# Altium schematic sheet DeskClock1.SchDoc
size B
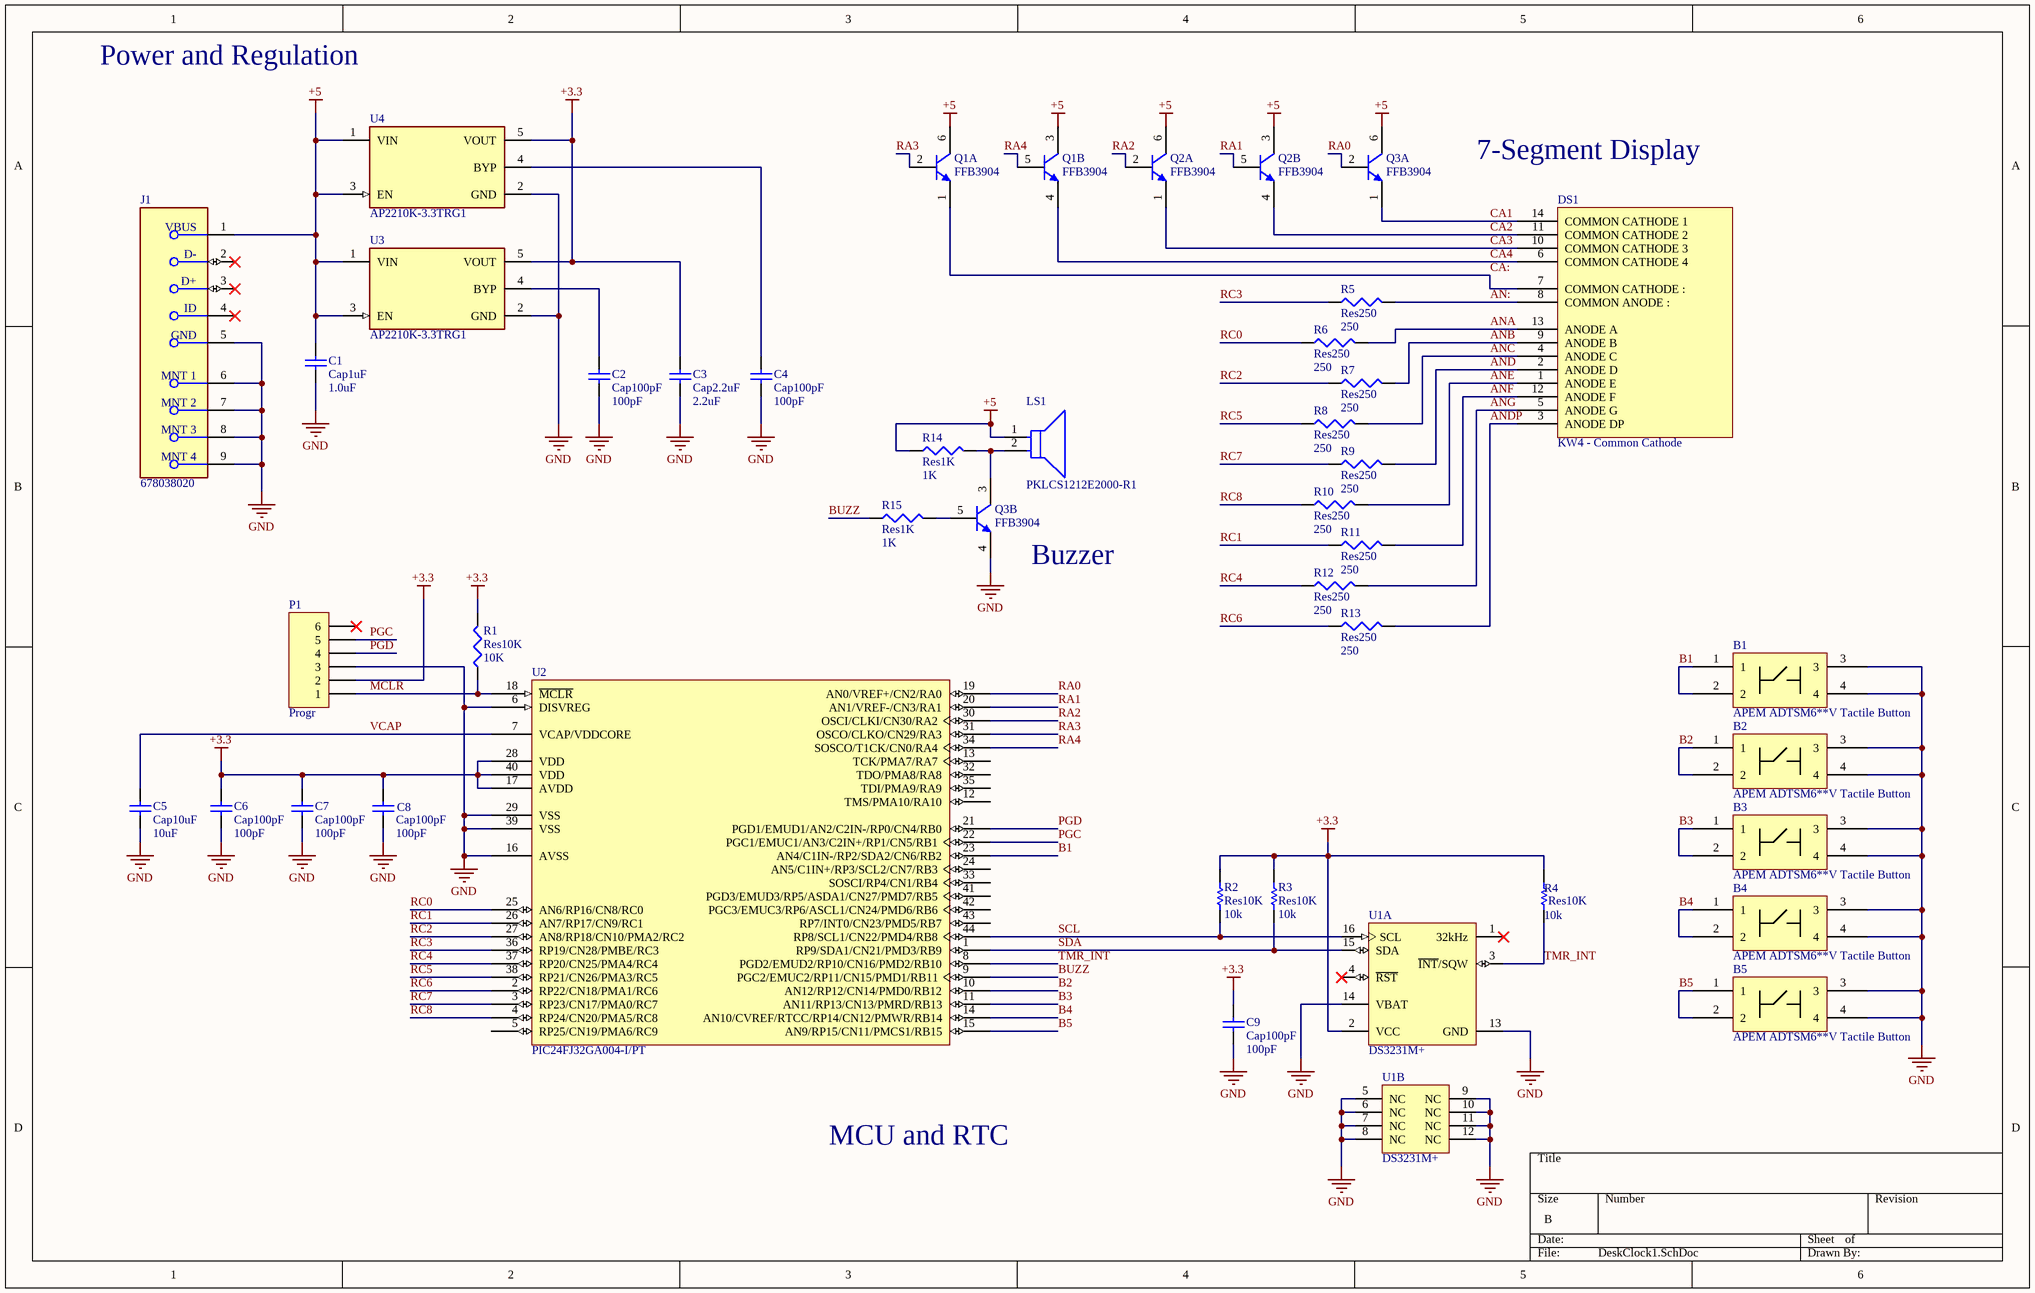
[diagram p0: DeskClock1.SchDoc]

## Parts
B1  APEM ADTSM6**V Tactile Button  [ADTSM6**V]
B2  APEM ADTSM6**V Tactile Button  [ADTSM6**V]
B3  APEM ADTSM6**V Tactile Button  [ADTSM6**V]
B4  APEM ADTSM6**V Tactile Button  [ADTSM6**V]
B5  APEM ADTSM6**V Tactile Button  [ADTSM6**V]
C1  Cap1uF  value 1.0uF  [C1206]
C2  Cap100pF  value 100pF  [C1206]
C3  Cap2.2uF  value 2.2uF  [C1206]
C4  Cap100pF  value 100pF  [C1206]
C5  Cap10uF  value 10uF  [C1206]
C6  Cap100pF  value 100pF  [C1206]
C7  Cap100pF  value 100pF  [C1206]
C8  Cap100pF  value 100pF  [C1206]
C9  Cap100pF  value 100pF  [C1206]
DS1  KW4 - Common Cathode  [KW4-56]
J1  678038020  [FP-678038020-MFG]
LS1  PKLCS1212E2000-R1  [FP-PKLCS1212E2000-R1-MFG]
P1  Progr  [HDR1X6]
Q1  FFB3904  [FAIR-SC70-6_V]  (parts A,B of 2)
Q2  FFB3904  [FAIR-SC70-6_V]  (parts A,B of 2)
Q3  FFB3904  [FAIR-SC70-6_V]  (parts A,B of 2)
R1  Res10K  value 10K  [C1206]
R2  Res10K  value 10k  [C1206]
R3  Res10K  value 10k  [C1206]
R4  Res10K  value 10k  [C1206]
R5  Res250  value 250  [C1206]
R6  Res250  value 250  [C1206]
R7  Res250  value 250  [C1206]
R8  Res250  value 250  [C1206]
R9  Res250  value 250  [C1206]
R10  Res250  value 250  [C1206]
R11  Res250  value 250  [C1206]
R12  Res250  value 250  [C1206]
R13  Res250  value 250  [C1206]
R14  Res1K  value 1K  [C1206]
R15  Res1K  value 1K  [C1206]
U1  DS3231M+  [W16MK+1_M]  (parts A,B of 2)
U2  PIC24FJ32GA004-I/PT  [TQFP-PT44_L]
U3  AP2210K-3.3TRG1  [FP-SOT25-MFG]
U4  AP2210K-3.3TRG1  [FP-SOT25-MFG]

## Nets
+3.3: C3.2 C6.2 C7.2 C8.2 C9.2 P1.2 R1.2 R2.2 R3.2 R4.2 U1.2(VCC) U2.17(AVDD) U2.28(VDD) U2.40(VDD) U3.5(VOUT) U4.5(VOUT)
+5: C1.2 J1.1(VBUS) LS1.1 Q1.3(C2) Q1.6(C1) Q2.3(C2) Q2.6(C1) Q3.6(C1) R14.1 U3.1(VIN) U3.3(EN) U4.1(VIN) U4.3(EN)
GND: B1.3 B1.4 B2.3 B2.4 B3.3 B3.4 B4.3 B4.4 B5.3 B5.4 C1.1 C2.1 C3.1 C4.1 C5.1 C6.1 C7.1 C8.1 C9.1 J1.5(GND) J1.6(MNT_1) J1.7(MNT_2) J1.8(MNT_3) J1.9(MNT_4) P1.3 Q3.4(E2) U1.5(NC) U1.6(NC) U1.7(NC) U1.8(NC) U1.9(NC) U1.10(NC) U1.11(NC) U1.12(NC) U1.13(GND) U1.14(VBAT) U2.6(DISVREG) U2.16(AVSS) U2.29(VSS) U2.39(VSS) U3.2(GND) U4.2(GND)
AN:: DS1.8(COMMON_ANODE_:) R5.2
ANA: DS1.13(ANODE_A) R6.2
ANB: DS1.9(ANODE_B) R7.2
ANC: DS1.4(ANODE_C) R8.2
AND: DS1.2(ANODE_D) R9.2
ANDP: DS1.3(ANODE_DP) R13.2
ANE: DS1.1(ANODE_E) R10.2
ANF: DS1.12(ANODE_F) R11.2
ANG: DS1.5(ANODE_G) R12.2
B1: B1.1 B1.2 U2.23(AN4/C1IN-/RP2/SDA2/CN6/RB2)
B2: B2.1 B2.2 U2.10(AN12/RP12/CN14/PMD0/RB12)
B3: B3.1 B3.2 U2.11(AN11/RP13/CN13/PMRD/RB13)
B4: B4.1 B4.2 U2.14(AN10/CVREF/RTCC/RP14/CN12/PMWR/RB14)
B5: B5.1 B5.2 U2.15(AN9/RP15/CN11/PMCS1/RB15)
BUZZ: R15.1 U2.9(PGC2/EMUC2/RP11/CN15/PMD1/RB11)
CA1: DS1.14(COMMON_CATHODE_1) Q3.1(E1)
CA2: DS1.11(COMMON_CATHODE_2) Q2.4(E2)
CA3: DS1.10(COMMON_CATHODE_3) Q2.1(E1)
CA4: DS1.6(COMMON_CATHODE_4) Q1.4(E2)
CA:: DS1.7(COMMON_CATHODE_:) Q1.1(E1)
MCLR: P1.1 R1.1 U2.18(~{MCLR})
PGC: P1.5 U2.22(PGC1/EMUC1/AN3/C2IN+/RP1/CN5/RB1)
PGD: P1.4 U2.21(PGD1/EMUD1/AN2/C2IN-/RP0/CN4/RB0)
RA0: Q3.2(B1) U2.19(AN0/VREF+/CN2/RA0)
RA1: Q2.5(B2) U2.20(AN1/VREF-/CN3/RA1)
RA2: Q2.2(B1) U2.30(OSCI/CLKI/CN30/RA2)
RA3: Q1.2(B1) U2.31(OSCO/CLKO/CN29/RA3)
RA4: Q1.5(B2) U2.34(SOSCO/T1CK/CN0/RA4)
RC0: R6.1 U2.25(AN6/RP16/CN8/RC0)
RC1: R11.1 U2.26(AN7/RP17/CN9/RC1)
RC2: R7.1 U2.27(AN8/RP18/CN10/PMA2/RC2)
RC3: R5.1 U2.36(RP19/CN28/PMBE/RC3)
RC4: R12.1 U2.37(RP20/CN25/PMA4/RC4)
RC5: R8.1 U2.38(RP21/CN26/PMA3/RC5)
RC6: R13.1 U2.2(RP22/CN18/PMA1/RC6)
RC7: R9.1 U2.3(RP23/CN17/PMA0/RC7)
RC8: R10.1 U2.4(RP24/CN20/PMA5/RC8)
SCL: R2.1 U1.16(SCL) U2.44(RP8/SCL1/CN22/PMD4/RB8)
SDA: R3.1 U1.15(SDA) U2.1(RP9/SDA1/CN21/PMD3/RB9)
TMR_INT: R4.1 U1.3(~{INT}/SQW) U2.8(PGD2/EMUD2/RP10/CN16/PMD2/RB10)
VCAP: C5.2 U2.7(VCAP/VDDCORE)
NetC2_2: C2.2 U3.4(BYP)
NetC4_2: C4.2 U4.4(BYP)
NetLS1_2: LS1.2 Q3.3(C2) R14.2
NetQ3_5: Q3.5(B2) R15.2

Not connected (* = marked no-connect by the designer): J1 2(D-)* 3(D+)* 4(ID)*; P1 6*; U1 1(32kHz)* 4(~{RST})*; U2 5(RP25/CN19/PMA6/RC9) 12(TMS/PMA10/RA10) 13(TCK/PMA7/RA7) 24(AN5/C1IN+/RP3/SCL2/CN7/RB3) 32(TDO/PMA8/RA8) 33(SOSCI/RP4/CN1/RB4) 35(TDI/PMA9/RA9) 41(PGD3/EMUD3/RP5/ASDA1/CN27/PMD7/RB5) 42(PGC3/EMUC3/RP6/ASCL1/CN24/PMD6/RB6) 43(RP7/INT0/CN23/PMD5/RB7)

## Notes on the sheet
- Power and Regulation
- 7-Segment Display
- (near Q3) Buzzer
- MCU and RTC

## Library data of the parts
B1-B5 = Button: ADTSM6**V
C1-C9 = Cap Semi: Capacitor (Semiconductor SIM Model); Published: 8-Jun-2000; LatestRevisionDate: 29-May-2009; LatestRevisionNote: IPC-7351 Footprint Added.; PackageReference: C1206; Publisher: Altium Limited; PackageDescription: Chip Capacitor
DS1 = KW4 - Common Cathode: Lucky Light 4-digit 7 segment clock display
J1 = CMP-04767-000002-1: CONN RCPT USB2.0 MINI AB SMD R/A; Manufacturer: Molex; Is Female: yes; Pitch: 0.8mm; Number Of Contacts: 5; Conn Orientation: Right Angle; Voltage Rating: 30V; Shielding: true; Current Rating: 1A; Octopart: https://octopart.com/67803-8020-molex-7136109; ComponentLink2Description: Datasheet; Lead Free: Yes; Temperature Range Low: 0°C; Manufacturer Part Number: 678038020; Temperature: 0°C to +50°C; Usb Standard: USB 2.0; Device Class L2: USB Connectors; Device Class L3: unset; Category: Conn; Temperature Range High: +50°C; Mouser Description: Conn Mini-USB Type AB RCP 5 POS 0.8mm Solder RA SMD 5 Terminal 1 Port Embossed T/R; Device Class L1: Connectors; Ambient Temperature Range Low: 0°C; Contact Material: Gold,Nickel; Ambient Temperature Range High: +50°C; Height: 4.1mm; Package: 0; RoHS: TRUE; Digikey Description: CONN RCPT USB2.0 MINI AB SMD R/A; Automotive: No; Footprint Url: https://www.molex.com/pdm_docs/sd/678038020_sd.pdf; ComponentLink2URL: https://www.molex.com/webdocs/datasheets/pdf/en-us/0678038020_IO_CONNECTORS.pdf
LS1 = CMP-06202-000001-1: AUDIO PIEZO TRANSDUCER 12.5V SMD; Manufacturer: Murata; Frequency: 2kHz; Digikey Description: AUDIO PIEZO TRANSDUCER 12.5V SMD; RoHS: TRUE; Device Class L3: Buzzers; Manufacturer Part Number: PKLCS1212E2000-R1; Automotive: No; Category: Speak; Height: 3mm; Operating Supply Voltage: 12.5V; Mouser Description: Piezo buzzer SMD; Temperature Range High: +70°C; Temperature Range Low: -20°C; ComponentLink2Description: Datasheet; ComponentLink2URL: https://www.murata.com/en-global/products/productdata/8801054425118/SPEC-PKLCS1212E2000-R1.pdf?1517839212000; Package: PKLCS1212E2000-R1; Device Class L1: Electromechanical; Device Class L2: Audio Products; Lead Free: Yes; Temperature: -20°C to +70°C; Octopart: https://octopart.com/pklcs1212e2000-r1-murata-7123179
P1 = Header 6: Header, 6-Pin; LatestRevisionDate: 17-Jul-2002; LatestRevisionNote: Re-released for DXP Platform.; Publisher: Altium Limited
Q1-Q3 = CMP-2000-06266-1: NPN Multi-Chip General Purpose Amplifier, 200 mA, 40 V, -55 to 150 degC, 6-Pin SC70, RoHS, Tape and Reel; Manufacturer: FairchildSemiconductor; Maximum Collector Emitter Saturation Voltage: 0.2@1mA@10mA; Maximum Collector Base Voltage: 60V; Maximum Power Dissipation: 300mW; Maximum DC Collector Current: 0.2A; Maximum Collector Emitter Voltage: 40V; Rad Hard: No; Maximum Operating Frequency: 250(Typ)MHz; Minimum DC Current Gain: 40@0.1mA@1V; Pin Count: 6; Packaging: Tape&Reel; Category: GPBJT; Datasheet Version: Rev. 1.1.1, 12/2013; Package URL: https://www.fairchildsemi.com/package-drawings/MA/MAA06A.pdf; Manufacturer URL: https://www.fairchildsemi.com/; Mounting Technology: SurfaceMount; Operating Temperature: -55to150°C; Package Reference: SC70-6; Mounting: SurfaceMount; Package Description: 6-Pin Small Outline Transistor, Body 2 x 1.25 mm, Pitch 0.65 mm; Package: 6SC-70; Type: NPN; Datasheet URL: https://www.fairchildsemi.com/datasheets/FF/FFB3904.pdf
R1 R5-R15 = Res3: Resistor; Published: 8-Jun-2000; LatestRevisionDate: 29-May-2009; LatestRevisionNote: IPC-7351 Footprint Added.; PackageReference: J1-0603; Publisher: Altium Limited; PackageDescription: Chip Resistor
R2-R4 = Res1: Resistor; Published: 8-Jun-2000; LatestRevisionDate: 17-Jul-2002; LatestRevisionNote: Re-released for DXP Platform.; PackageReference: AXIAL-0.3; Publisher: Altium Limited; PackageDescription: Axial Device, Thru-Hole; 2 Leads; 0.3 in Pin Spacing
U1 = CMP-0254-00003-2: +/-5ppm, MEMS based Real-Time Clock, I2C Interface, 16-Pin SO, -40 to 85 degC, Pb-Free; ComponentLink1Description: Manufacturer URL; PackageReference: W16MK+1; DatasheetVersion: Rev 3, Dec-2011; PackageDescription: 16-Pin Small-Outline IC, Wide (0.3in), 1.27 mm Pitch, SOIC (W), Pb-Free; ComponentLink3Description: Package Specification; ComponentLink2URL: http://datasheets.maxim-ic.com/en/ds/DS3231M.pdf; PackageVersion: revD, 2010; ComponentLink1URL: http://www.maxim-ic.com; Code_IPC: SOIC127P1030-16; ComponentLink2Description: Datasheet; ComponentLink3URL: http://pdfserv.maxim-ic.com/package_dwgs/21-0042.PDF; Code_JEDEC: MS-013-AA
U2 = CMP-0046-00196-2: General Purpose 16-Bit Flash Microcontroller, 32KB Flash, 8KB SRAM, 44-Pin TQFP, Industrial Temperature; DatasheetVersion: revD, Feb-2010; PackageReference: TQFP-PT44; RevisionNote: Component URLs added.; ComponentLink3URL: http://www.microchip.com/; ComponentLink1Description: Datasheet; ComponentLink3Description: Microchip.com Home; PackageDescription: 44-Lead Plastic Thin Quad Flatpack (PT) - 10x10x1mm Body, 2.00mm [TQFP]; ComponentLink1URL: http://ww1.microchip.com/downloads/en/DeviceDoc/39881D.pdf; PackageVersion: revBB, Aug-2009; Code_JEDEC: MS-026; ComponentLink2Description: Packaging Specification; ComponentLink2URL: http://www.microchip.com/stellent/groups/techpub_sg/documents/packagingspec/en012702.pdf
U3 U4 = CMP-12756-000023-1: IC REG LINEAR 3.3V 300MA SOT23-5; Manufacturer: Diodes; Number Of Outputs: 1; Max Supply Voltage: 13.2V; Max Junction Temp: +125°C; Accuracy Percentage: 1%; Nominal Supply Current: 0.01uA; Output Type: Fixed; Min Supply Voltage: 2.5V; Dropout Voltage: 250mV; Standoff Height: 0.013mm; Temperature: -40°C to +85°C; Temperature Range High: +85°C; Device Class L3: Voltage Regulators - Linear; Package: SOT25; ComponentLink2Description: Datasheet; ComponentLink2URL: https://www.diodes.com/assets/Datasheets/AP2210.pdf; Digikey Description: IC REG LINEAR 3.3V 300MA SOT23-5; Height: 1.4mm; Lead Free: Yes; Footprint Url: https://www.diodes.com/assets/Package-Files/SOT25.pdf; Mouser Description: LDO Voltage Regulators 300mA CMOS LDO 3.3V 250mV; Output Current: 300mA; Output Voltage: 3.3V; Category: IC; Octopart: https://octopart.com/ap2210k-3.3trg1-diodes+inc.-30954630; RoHS: TRUE; Device Class L1: Integrated Circuits (ICs); Temperature Range Low: -40°C; Device Class L2: Power Management ICs; Automotive: No; Manufacturer Part Number: AP2210K-3.3TRG1